# Altium schematic sheet Transmitter .SchDoc
size A3; SheetNumber: 1; SheetTotal: 1
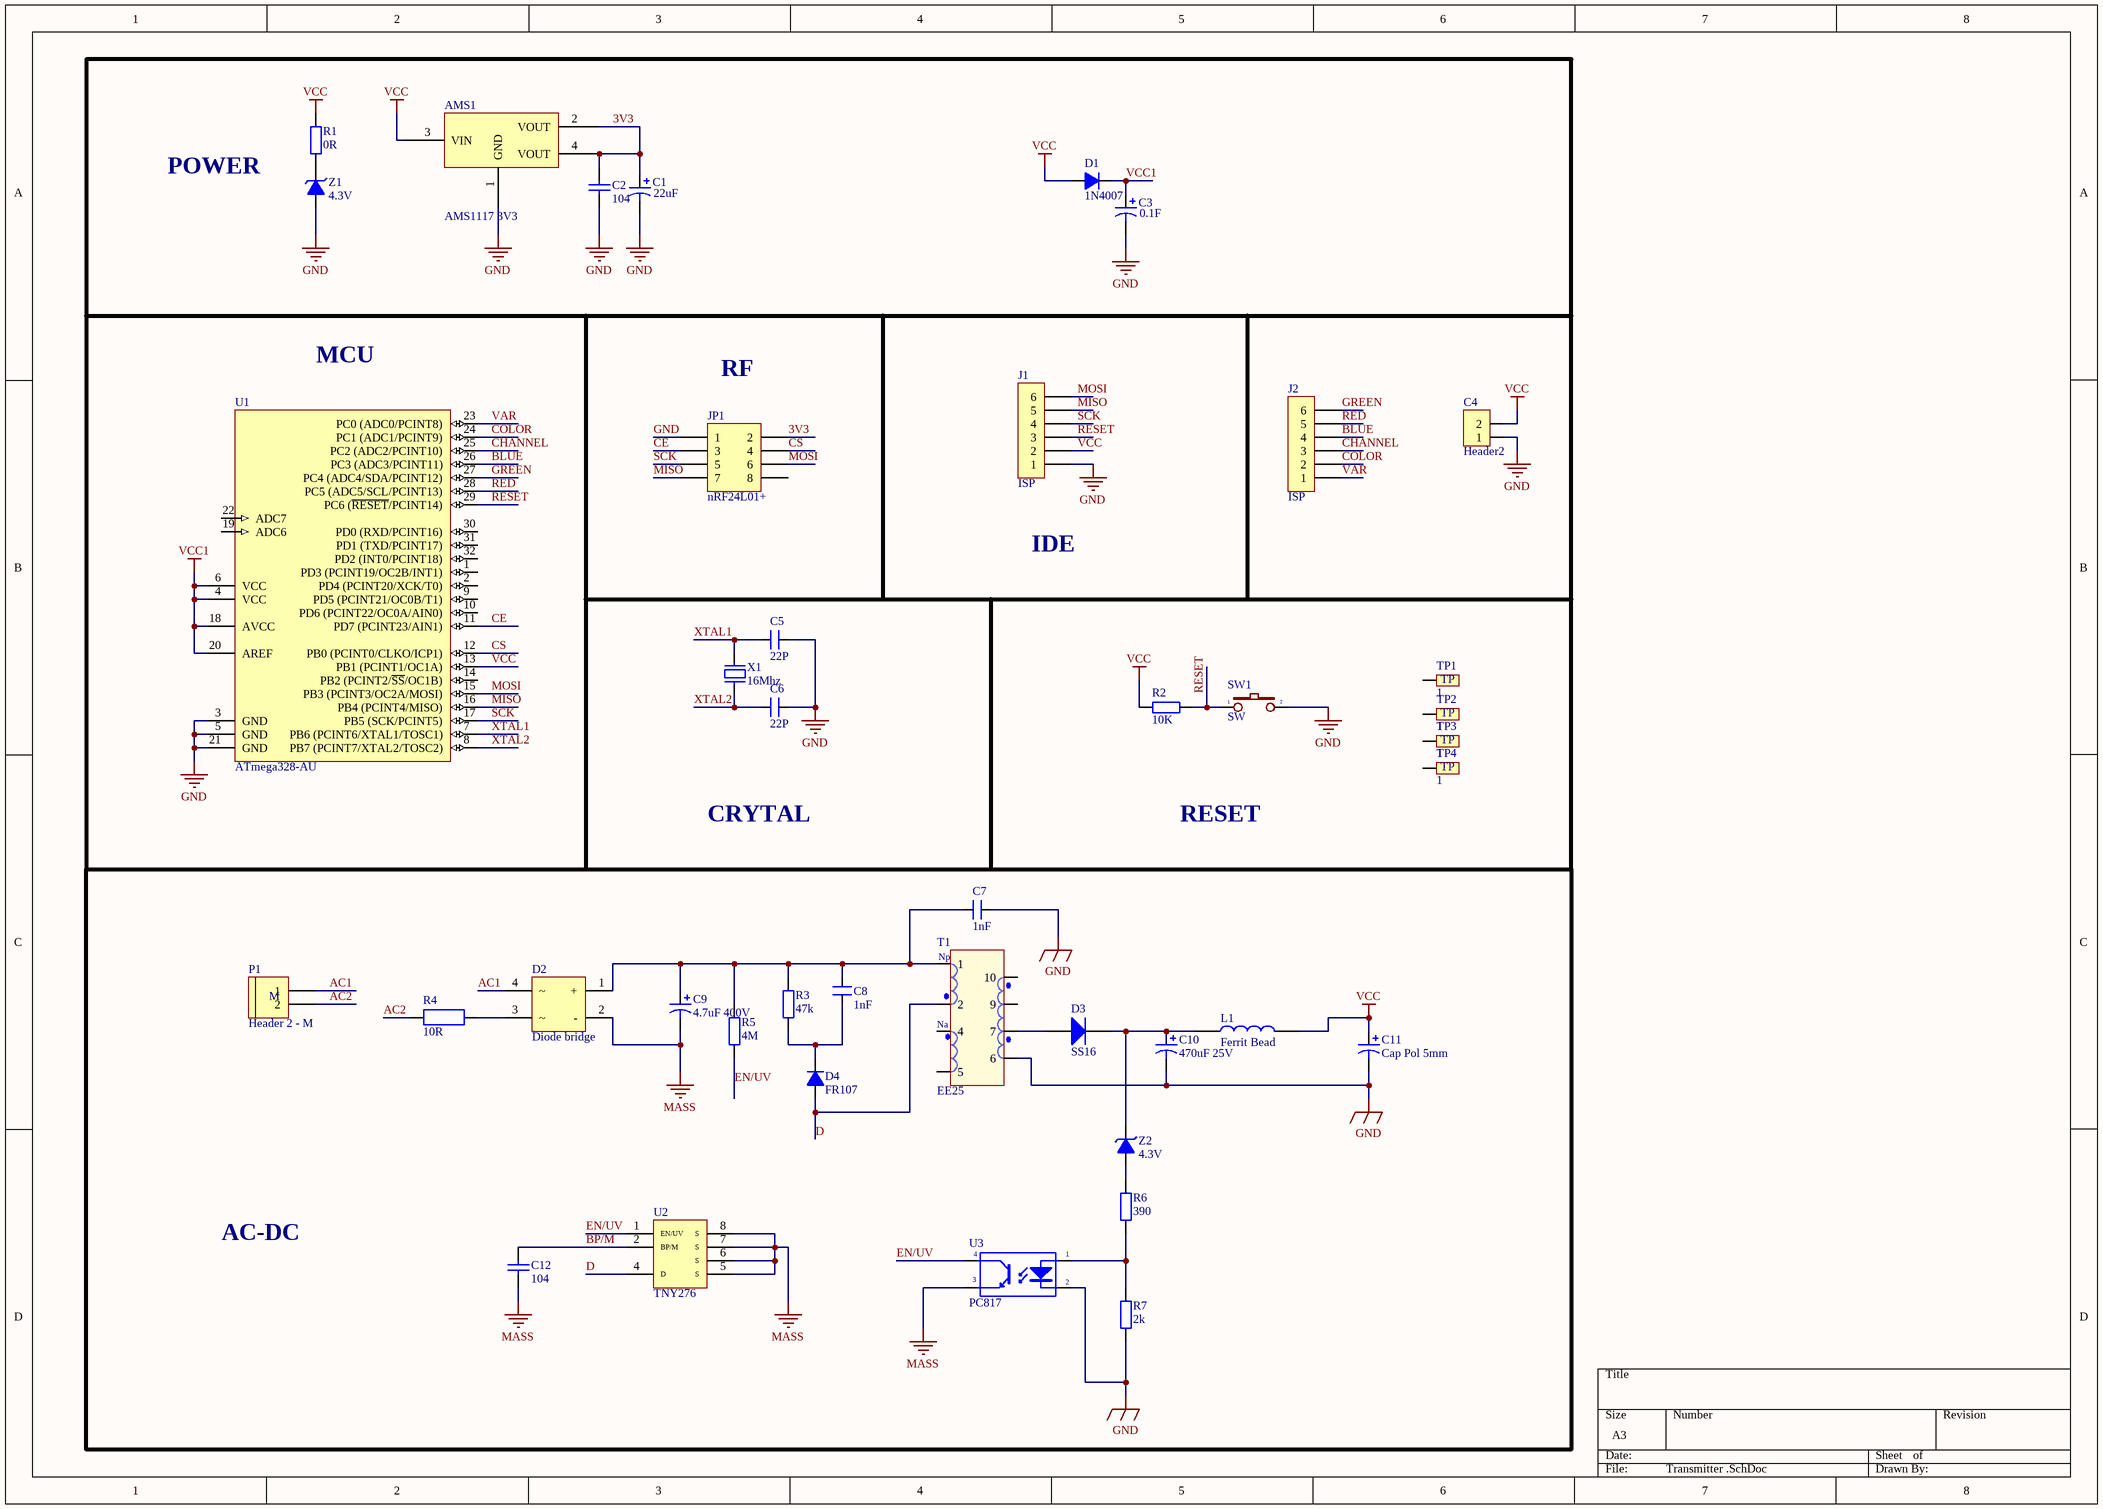
[diagram p0: Transmitter .SchDoc]

## Parts
AMS1  AMS1117 3V3  [SOT223-4N]
C1  22uF  [C5mm]
C2  104  [CN-SMD-0805]
C3  0.1F  [SUP CAP]
C4  Header2  [HDR2]
C5  22P  [CN-SMD-0805]
C6  22P  [CN-SMD-0805]
C7  1nF  [CN4]
C8  1nF  [CN2]
C9  4.7uF 400V  [C10mm]
C10  470uF 25V  [C10mm]
C11  Cap Pol 5mm  [C5mm]
C12  104  [CN-SMD-0805]
D1  1N4007  [D1A]
D2  Diode bridge  [DS207S]
D3  SS16  [SS14]
D4  FR107  [D1A]
J1  ISP  [Header6]
J2  ISP  [Header6]
JP1  nRF24L01+  [HDR2X4]
L1  Ferrit Bead  [CUON CAM]
P1  Header 2 - M  [Medium - Header 2]
R1  0R  [1206_R]
R2  10K  [RES-SMD-0805]
R3  47k  [RES-SMD-0805]
R4  10R  [RES-1W-LONG]
R5  4M  [RES-SMD-0805]
R6  390  [RES-SMD-0805]
R7  2k  [RES-SMD-0805]
SW1  SW  [SW2]
T1  EE25  [EE19 5+5]
TP1  1  [Holle 3mm 8mm]
TP2  1  [Holle 3mm 8mm]
TP3  1  [Holle 3mm 8mm]
TP4  1  [Holle 3mm 8mm]
U1  ATmega328-AU  [TQFP32]
U2  TNY276  [PCBComponent_1]
U3  PC817  [DIP4/W0.3]
X1  16Mhz  [XT2]
Z1  4.3V  [D1A]
Z2  4.3V  [D1A]

## Nets
GND: AMS1.1(GND) C1.2 C2.1 C3.2 C4.1 C5.1 C6.1 C7.2 C10.2 C11.2 J1.1 JP1.1 R7.1 SW1.2 T1.6 U1.3(GND) U1.5(GND) U1.21(GND) U3.2(K) Z1.1(A)
MASS: C9.2 C12.1 D2.2(-) U2.5(S) U2.6(S) U2.7(S) U2.8(S) U3.3(E)
VCC: AMS1.3(VIN) C4.2 C11.1 D1.1(A) J1.2 L1.2 R1.2 R2.1 U1.13(PB1_(PCINT1/OC1A))
VCC1: C3.1 D1.2(K) U1.4(VCC) U1.6(VCC) U1.18(AVCC) U1.20(AREF)
3V3: AMS1.2(VOUT) AMS1.4(VOUT) C1.1 C2.2 JP1.2
AC1: D2.4 P1.1
AC2: P1.2 R4.1
BLUE: J2.4 U1.26(PC3_(ADC3/PCINT11))
BP/M: C12.2 U2.2(BP/M)
CE: JP1.3 U1.11(PD7_(PCINT23/AIN1))
CHANNEL: J2.3 U1.25(PC2_(ADC2/PCINT10))
COLOR: J2.2 U1.24(PC1_(ADC1/PCINT9))
CS: JP1.4 U1.12(PB0_(PCINT0/CLKO/ICP1))
D: D4.1(A) T1.2 U2.4(D)
EN/UV: R5.1 U2.1(EN/UV) U3.4(C)
GREEN: J2.6 U1.27(PC4_(ADC4/SDA/PCINT12))
MISO: J1.5 JP1.7 U1.16(PB4_(PCINT4/MISO))
MOSI: J1.6 JP1.6 U1.15(PB3_(PCINT3/OC2A/MOSI))
RED: J2.5 U1.28(PC5_(ADC5/SCL/PCINT13))
RESET: J1.3 R2.2 SW1.1 U1.29(PC6_(~{RESET}/PCINT14))
SCK: J1.4 JP1.5 U1.17(PB5_(SCK/PCINT5))
VAR: J2.1 U1.23(PC0_(ADC0/PCINT8))
XTAL1: C5.2 U1.7(PB6_(PCINT6/XTAL1/TOSC1)) X1.2
XTAL2: C6.2 U1.8(PB7_(PCINT7/XTAL2/TOSC2)) X1.1
NetC7_1: C7.1 C8.2 C9.1 D2.1(+) R3.2 R5.2 T1.1
NetC8_1: C8.1 D4.2(K) R3.1
NetC10_1: C10.1 D3.2(K) L1.1 Z2.2(K)
NetD2_3: D2.3 R4.2
NetD3_1: D3.1(A) T1.7
NetR1_1: R1.1 Z1.2(K)
NetR6_1: R6.1 R7.2 U3.1(A)
NetR6_2: R6.2 Z2.1(A)

Not connected (* = marked no-connect by the designer): JP1 8; T1 4 5 9 10; TP1 TP1(0); TP2 TP1(0); TP3 TP1(0); TP4 TP1(0); U1 1(PD3_(PCINT19/OC2B/INT1)) 2(PD4_(PCINT20/XCK/T0)) 9(PD5_(PCINT21/OC0B/T1)) 10(PD6_(PCINT22/OC0A/AIN0)) 14(PB2_(PCINT2/~{SS}/OC1B)) 19(ADC6) 22(ADC7) 30(PD0_(RXD/PCINT16)) 31(PD1_(TXD/PCINT17)) 32(PD2_(INT0/PCINT18))

## Notes on the sheet
- POWER
- MCU
- RF
- IDE
- CRYTAL
- RESET
- AC-DC
- (in symbol EE25) Np; Na
- (in symbol Header 2 - M) M

## Library data of the parts
AMS1 = AMS1117: AMS
C1 C3 C11 = Cap Pol 5mm: Polarized Capacitor (Axial); Published: 8-Jun-2000; LatestRevisionDate: 17-Jul-2002; LatestRevisionNote: Re-released for DXP Platform.; PackageReference: POLAR0.8; Publisher: Altium Limited
C2 C12 = CAP 33P_0805
C4 = Header2: Header IDC, 2 x 1 Pin Vertical 2.54mm Pitch (Non-Boxed, Male); Manufacturer: W¨¹rth Elektronik eiSos GmbH; partNo: 613002143121; ComponentLink1 Description: Manufacturer; ComponentLink2 Description: Datasheet; NoPins: 02; Created Date: 29 March 2013; ComponentLink1URL: http://www.we-online.com; ComponentLink2URL: http://katalog.we-online.de/em/datasheet/6130xx143121.pdf; Created by: Karrer Zheng
C5 C6 = CN1: Cap np  1pF - 472pF; Value: 100pF
C7 = CN3: Cap np W0.3; Value: 0,047uF; Copyright: VanDungEvn
C8 = CN2: Cap np 104 => 105pF; Value: 0.1uF
C9 C10 = Cap Pol 8mm: Polarized Capacitor (Axial); Published: 8-Jun-2000; LatestRevisionDate: 17-Jul-2002; LatestRevisionNote: Re-released for DXP Platform.; PackageReference: POLAR0.8; Publisher: Altium Limited
D1 = D1A: Diode 1A; Value: 1N4007
D2 = DS207S: Diode cau 2A 1000V
D3 = Diode SS14 ( 1N5819): Dán; Ma_Hang: MH002211; Don_Vi: Con; Ten_Linh_Kien: Diode SS14 DO214 Schottky 1A 40V ( 1N5819 DO214); Chung_Loai: Dán; Ghi_Chu: *; Kieu_Chan: *
D4 = D1A: Diode 1A; Value: 1N4007
J1 J2 = JUMP 6: JUMP DON DUC 2.54
JP1 = JUMP DOI-4: JUMP DOI DUC; LatestRevisionDate: 17-Jul-2002; LatestRevisionNote: Re-released for DXP Platform.; Publisher: Altium Limited
L1 = CUON CAM 470uH DIP: Cuộn lọc RH3.5x9x0.8 Cắm; Don_Vi: Con; Ma_Hang: MH002232; Ten_Linh_Kien: Cuộn Cảm 470uH 3A 8x10MM; Ghi_Chu: *; Kieu_Chan: *; Chung_Loai: Cắm
P1 = Header 2 - M: Header, 2-Pin, Medium; LatestRevisionDate: 17-Jul-2002; LatestRevisionNote: Re-released for DXP Platform.; Publisher: Altium Limited
R1-R3 R5-R7 = R1/4W: Resistor 1/4W; Value: R1/4W - 1K
R4 = R1W: Resistor 1W; Value: R1W - 100
SW1 = SW2: Switch button 2 pin; Value: SW chip 2 pin
T1 = EE25: EE25 10PIN
TP1-TP4 = TP: CONNECT 1
U1 = ATmega328-AU: 8-bit AVR Microcontroller, 32KB Flash, 1KB EEPROM, 2KB SRAM, 32-pin TQFP, Industrial Grade (-40°C to 85°C); Published: 1-Apr-2010; DatasheetVersion: revA, Jan-2010; PackageVersion: revB, Oct-2001; PackageReference: 32A; Publisher: Altium Limited; PackageDescription: 32-Lead, 7x7x1.0 mm Body, 0.8mm Lead Pitch, Thin Profile Plastic Quad Flat Package (TQFP); Supplier 1: Digi-Key; Supplier Part Number 1: ATMEGA328-AU-ND; Supplier 2: Mouser; Supplier Part Number 2: 556-ATMEGA328-AU; Code_JEDEC: MS-026-ABA; ComponentLink1Description: Manufacturer Link; ComponentLink1URL: http://www.atmel.com/products/avr/default.asp?; ComponentLink2Description: ATmega48A/48PA/88A/88PA/168A/168PA/328/328P Datasheet; ComponentLink2URL: http://www.atmel.com/dyn/resources/prod_documents/8271.pdf; ComponentLink3Description: ATmega48A/48PA/88A/88PA/168A/168PA/328/328P Summary; ComponentLink3URL: http://www.atmel.com/dyn/resources/prod_documents/8271S.pdf; ComponentLink4Description: Atmel.com Home; ComponentLink4URL: http://www.atmel.com
U2 = TNY276: TNY274-280 / TinySwitch-III Family - DIP/PDIP-8C
U3 = PC817: Single Opto; Value: PC817
X1 = XT2: Crystal For all Crystal 2pin.; Value: 4Mhz
Z1 Z2 = Diode Zener: Diode  Zener